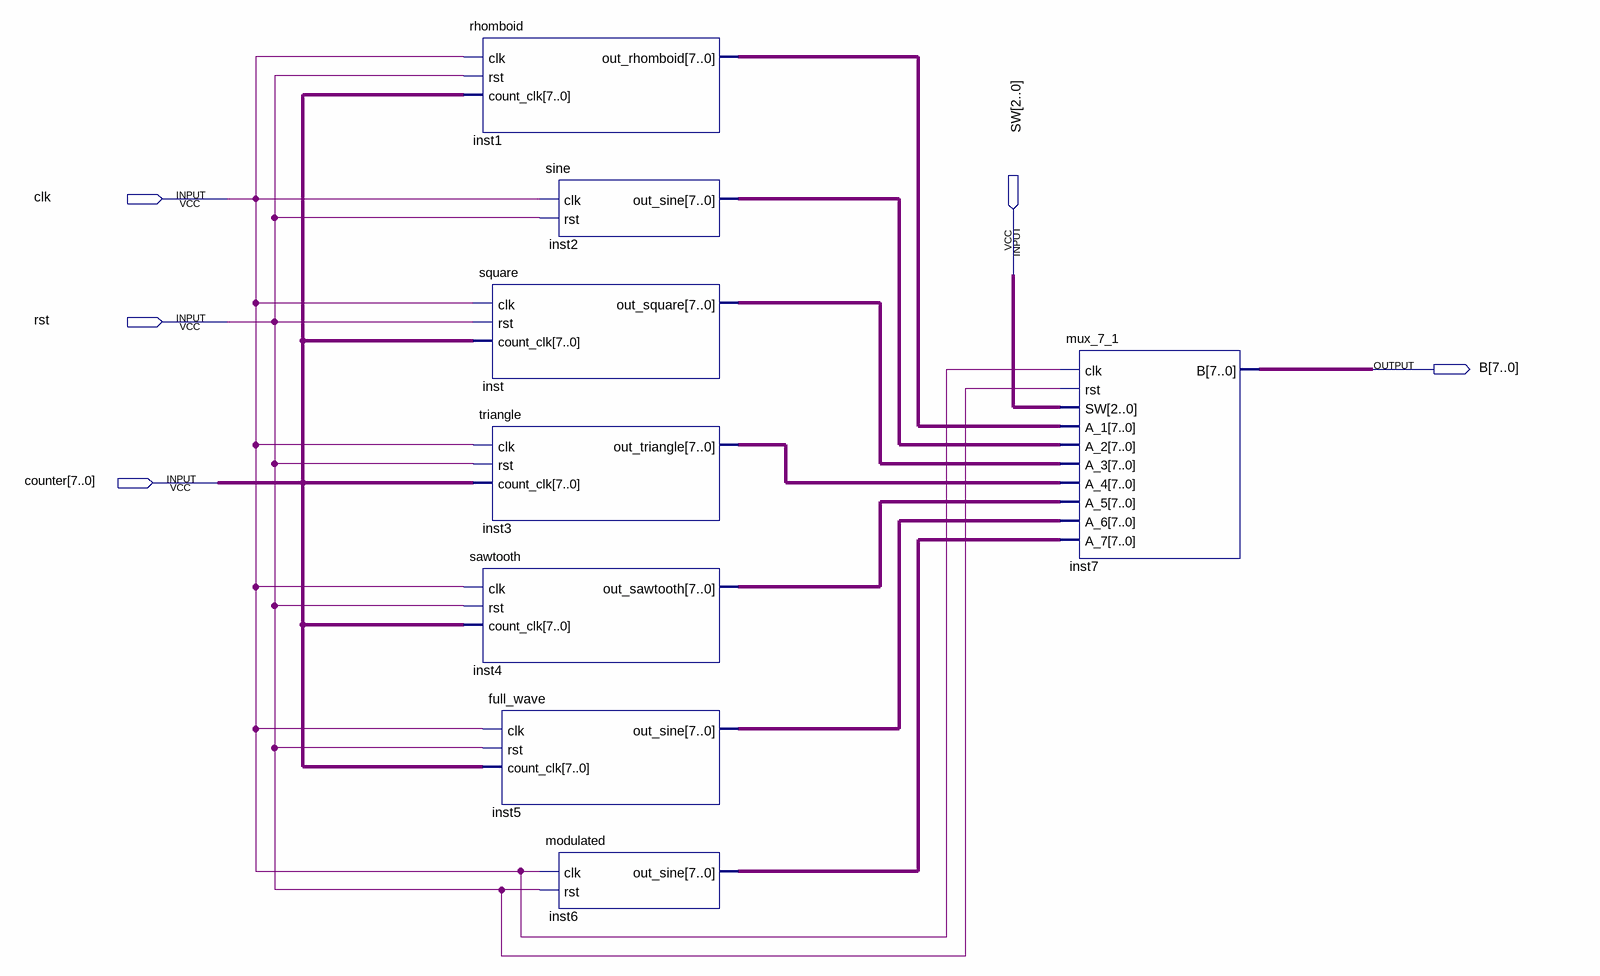
[diagram p0: schematic sheet]
// Quartus schematic processor.bdf as structural Verilog: 8 symbols, 5 pins
module processor (
  input  clk,
  input  [2:0] SW,
  input  rst,
  input  [7:0] counter,
  output [7:0] B
);

  wire [7:0] inst1_out_rhomboid, inst2_out_sine, inst3_out_triangle, inst4_out_sawtooth, inst5_out_sine,
       inst6_out_sine, inst_out_square;

  rhomboid inst1 (.clk(clk), .rst(rst), .count_clk(counter), .out_rhomboid(inst1_out_rhomboid));
  square inst (.clk(clk), .rst(rst), .count_clk(counter), .out_square(inst_out_square));
  triangle inst3 (.clk(clk), .rst(rst), .count_clk(counter), .out_triangle(inst3_out_triangle));
  sawtooth inst4 (.clk(clk), .rst(rst), .count_clk(counter), .out_sawtooth(inst4_out_sawtooth));
  full_wave inst5 (.clk(clk), .rst(rst), .count_clk(counter), .out_sine(inst5_out_sine));
  sine inst2 (.clk(clk), .rst(rst), .out_sine(inst2_out_sine));
  modulated inst6 (.clk(clk), .rst(rst), .out_sine(inst6_out_sine));
  mux_7_1 inst7 (
    .clk(clk), .rst(rst), .SW(SW), .A_1(inst1_out_rhomboid), .A_2(inst2_out_sine), .A_3(inst_out_square),
    .A_4(inst3_out_triangle), .A_5(inst4_out_sawtooth), .A_6(inst5_out_sine), .A_7(inst6_out_sine), .B(B));
endmodule
